# EAGLE design individual-board (EAGLE 9.6.2)
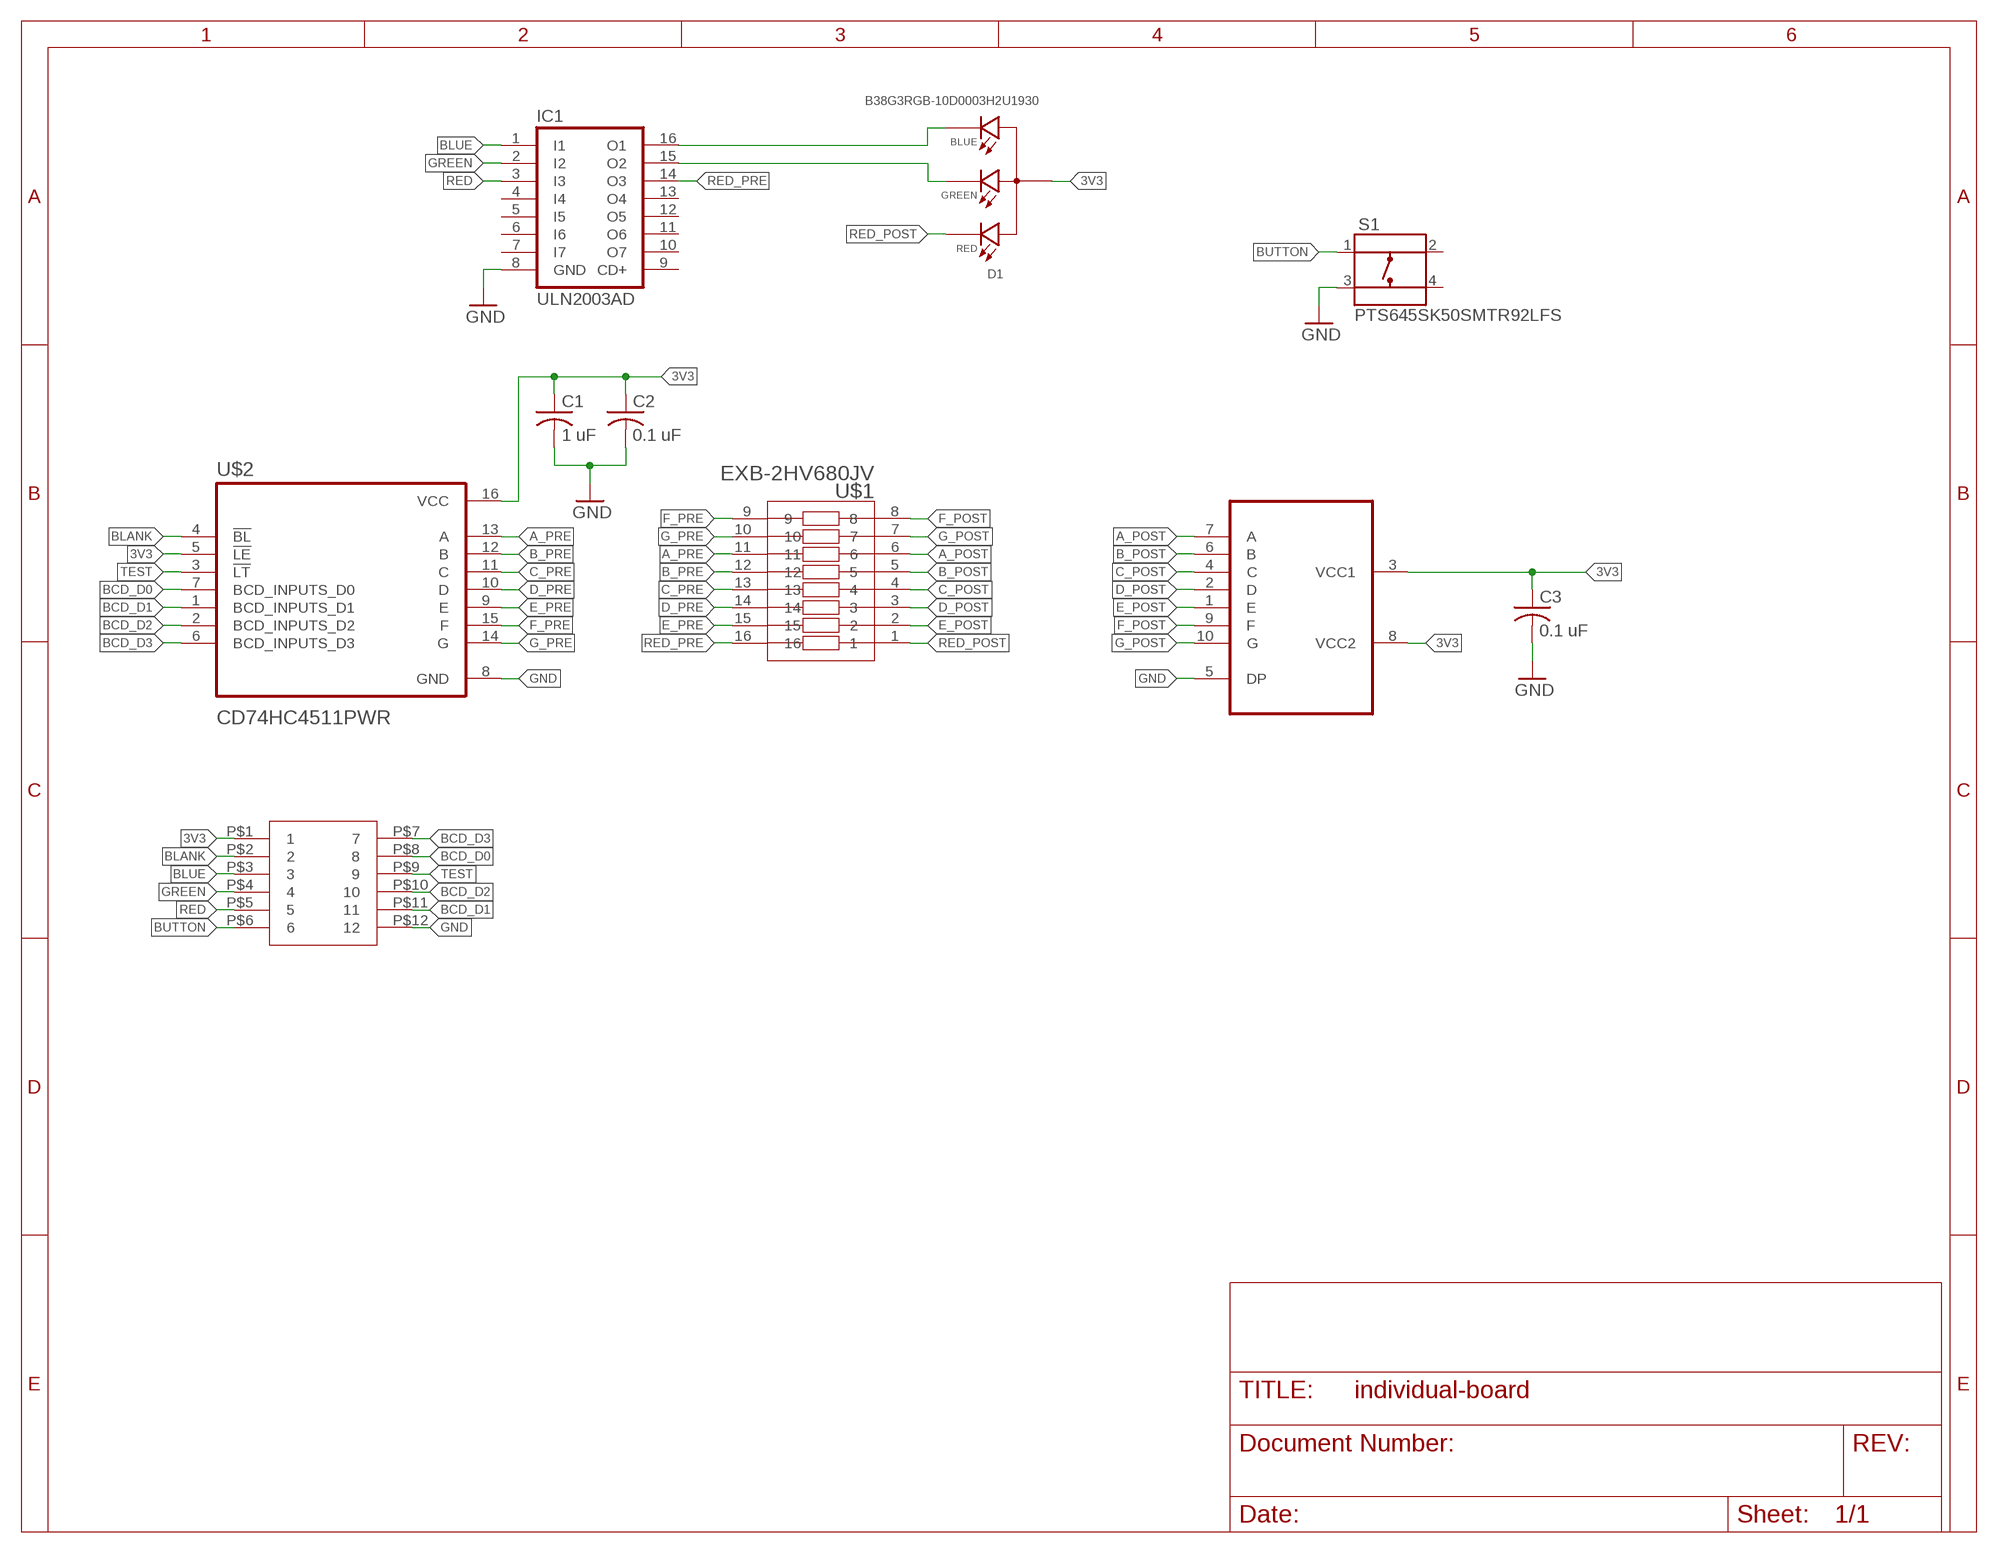
[diagram p0: schematic, sheet 1]

## Parts
C1  1 uF  C-USC0603  [C0603]
C2  0.1 uF  C-USC0603  [C0603]
C3  0.1 uF  C-USC0603  [C0603]
D1  B38G3RGB-10D0003H2U1930  [LED_B38G3RGB-10D0003H2U1930]
IC1  ULN2003AD  [SO16]
S1  PTS645SK50SMTR92LFS  [SW_PTS645SK50SMTR92LFS]
U$1  EXB-2HV680JV  EXB-2HV101JV  [2HV]
U$2  CD74HC4511PWR  [CD74HC4511PWR]
U$3  INND-SS30RAB  [INND-SS30RAB]
U$4  2X6-EDGE-CONNECTOR  [2X6-EDGE-CONNECTOR]

## Nets
3V3: C1.1 C2.1 C3.1 D1.3(A) U$2.5(!LE) U$2.16(VCC) U$3.3(VCC1) U$3.8(VCC2) U$4.P$1
A_POST: U$1.6 U$3.7(A)
A_PRE: U$1.11 U$2.13(A)
B_POST: U$1.5 U$3.6(B)
B_PRE: U$1.12 U$2.12(B)
BCD_D0: U$2.7(BCD_INPUTS_D0) U$4.P$8
BCD_D1: U$2.1(BCD_INPUTS_D1) U$4.P$11
BCD_D2: U$2.2(BCD_INPUTS_D2) U$4.P$10
BCD_D3: U$2.6(BCD_INPUTS_D3) U$4.P$7
BLANK: U$2.4(!BL) U$4.P$2
BLUE: IC1.1(I1) U$4.P$3
BUTTON: S1.1 U$4.P$6
C_POST: U$1.4 U$3.4(C)
C_PRE: U$1.13 U$2.11(C)
D_POST: U$1.3 U$3.2(D)
D_PRE: U$1.14 U$2.10(D)
E_POST: U$1.2 U$3.1(E)
E_PRE: U$1.15 U$2.9(E)
F_POST: U$1.8 U$3.9(F)
F_PRE: U$1.9 U$2.15(F)
G_POST: U$1.7 U$3.10(G)
G_PRE: U$1.10 U$2.14(G)
GND: C1.2 C2.2 C3.2 IC1.8(GND) S1.3 U$2.8(GND) U$3.5(DP) U$4.P$12
GREEN: IC1.2(I2) U$4.P$4
N$8: D1.2(B_C) IC1.16(O1)
N$17: D1.1(G_C) IC1.15(O2)
RED: IC1.3(I3) U$4.P$5
RED_POST: D1.4(R_C) U$1.1
RED_PRE: IC1.14(O3) U$1.16
TEST: U$2.3(!LT) U$4.P$9
Unconnected: IC1.4(I4) IC1.5(I5) IC1.6(I6) IC1.7(I7) IC1.9(CD+) IC1.10(O7) IC1.11(O6) IC1.12(O5) IC1.13(O4) S1.2 S1.4

## Library data of the parts
C1-C3 = rcl:C-US: CAPACITOR, American symbol; SPICEPREFIX: C
D1 = B38G3RGB-10D0003H2U1930:B38G3RGB-10D0003H2U1930; DESCRIPTION: Red, Green, Blue (RGB) - LED Indication - Discrete 2V Red, 3V Green, 3V Blue 0606 (1616 Metric); DIGI-KEY_PART_NUMBER: 3147-B38G3RGB-10D0003H2U1930TR-ND; MF: Harvatek Corporation; MP: B38G3RGB-10D0003H2U1930; PACKAGE: None; PURCHASE-URL: https://pricing.snapeda.com/search/part/B38G3RGB-10D0003H2U1930/?ref=eda
IC1 = uln-udn:ULN2003A: DRIVER ARRAY
S1 = PTS645SL70SMTR92LFS:PTS645SK50SMTR92LFS: Switch Tactile N.O. SPST Round Button Gull Wing 0.05A 12VDC 100000Cycles 2.55N SMD T/R; DESCRIPTION: Tactile Switch SPST-NO Top Actuated Surface Mount; DIGI-KEY_PART_NUMBER: CKN9087TR-ND; MF: C&K; MP: PTS645SK50SMTR92LFS; PACKAGE: None; PURCHASE-URL: https://pricing.snapeda.com/search/part/PTS645SK50SMTR92LFS/?ref=eda
U$1 = EXB-2HV101JV:EXB-2HV101JV; DESCRIPTION: 100 Ohm ±5% 62.5mW Power Per Element Isolated 8 Resistor Network/Array ±200ppm/°C 1506, Convex, Long Side Terminals; DIGI-KEY_PART_NUMBER: Y1101TR-ND; MF: Panasonic Electronic; MP: EXB-2HV101JV; PACKAGE: 1506 Panasonic; PURCHASE-URL: https://pricing.snapeda.com/search/part/EXB-2HV101JV/?ref=eda
U$2 = CD74HC4511PWR:CD74HC4511PWR
U$3 = INND-SS30RAB:INND-SS30RAB
U$4 = 2x6-edge-connector:2X6-EDGE-CONNECTOR

## Board
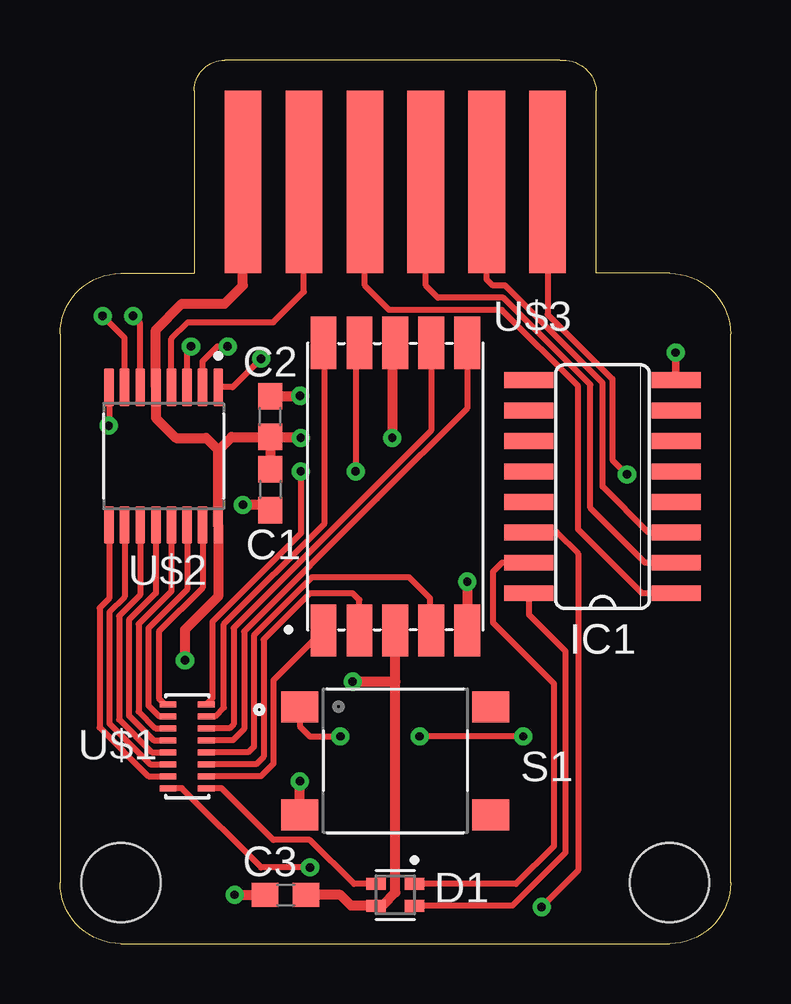
[diagram p1: board, top side]
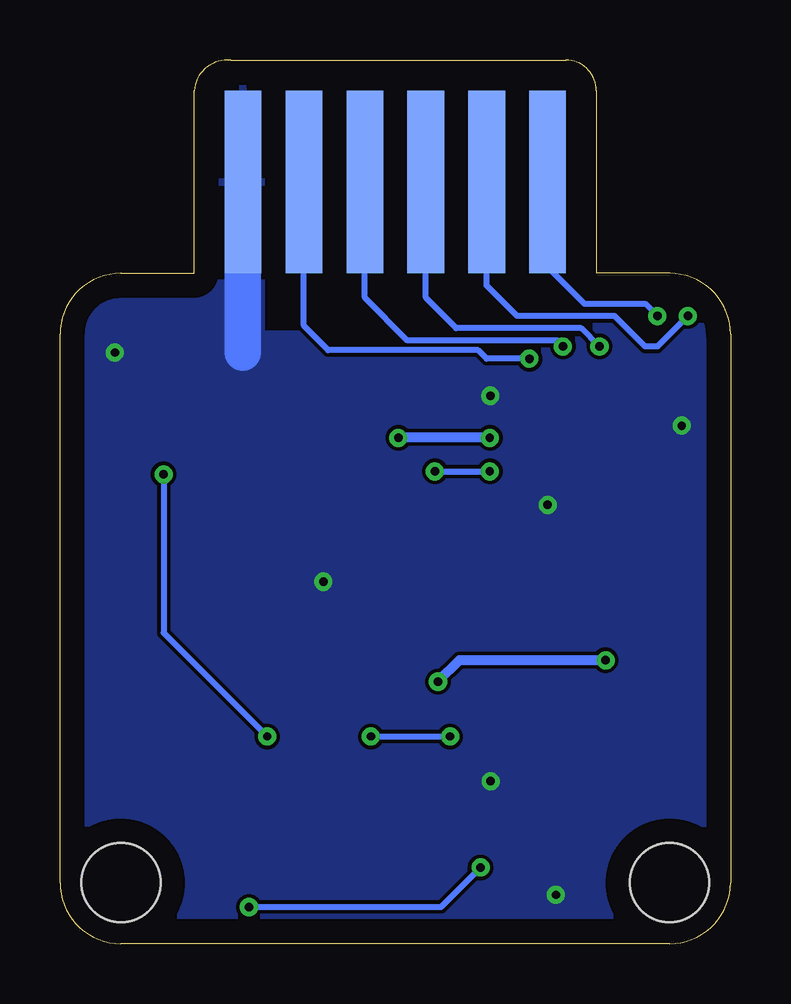
[diagram p2: board, bottom side, seen from below]

Size 27.94 x 36.84 mm. Coordinates in mm from the lower left corner, seen from the top.
Outline: 2.54,0 25.4,0 arc90 27.94,2.54 27.94,25.4 arc90 25.4,27.94 22.35,27.94 22.35,35.56 arc90 20.83,36.83 6.86,36.83 arc90 5.59,35.56 5.59,27.94 2.54,27.94 arc90 0,25.4 0,2.54 arc90 2.54,0
Copper layers (1*16): Top 0.035mm / dielectric 1.5mm / Bottom 0.035mm
Design rules "default": minimum track width 6mil, minimum drill 0.35mm, track to track 6mil, track to pad 6mil, pad to pad 6mil, via to via 6mil, smd to smd 6mil, copper to edge 40mil, drill to drill 6mil, minimum pad ring 10mil, minimum via ring 8mil, stop-mask expansion 4mil, vias tented up to drill 0mil, thermal gap 10mil
Holes 3.3 mm at 2.54,2.54 25.4,2.54

### Footprints (pad centres in the part's own frame; a part is rotated, then mirrored left to right if it is on the bottom)
C0603 = smd 1.1 x 1: 1 -0.85,0; 2 0.85,0
LED_B38G3RGB-10D0003H2U1930 = smd 0.5 x 0.8: 1 -0.45,0.8; 2 0.45,0.8; 3 0.45,-0.8; 4 -0.45,-0.8
SO16 = smd 0.66 x 2.032: 1 -4.445,-3.073; 2 -3.175,-3.073; 3 -1.905,-3.073; 4 -0.635,-3.073; 5 0.635,-3.073; 6 1.905,-3.073; 7 3.175,-3.073; 8 4.445,-3.073; 9 4.445,3.073; 10 3.175,3.073; 11 1.905,3.073; 12 0.635,3.073; 13 -0.635,3.073; 14 -1.905,3.073; 15 -3.175,3.073; 16 -4.445,3.073
SW_PTS645SK50SMTR92LFS = smd 1.55 x 1.3: 1 -3.975,2.25; 2 3.975,2.25; 3 -3.975,-2.25; 4 3.975,-2.25
2HV = smd 0.25 x 0.7: 1 0,0; 2 0.5,0; 3 1,0; 4 1.5,0; 5 2,0; 6 2.5,0; 7 3,0; 8 3.5,0; 9 3.5,1.6; 10 3,1.6; 11 2.5,1.6; 12 2,1.6; 13 1.5,1.6; 14 1,1.6; 15 0.5,1.6; 16 0,1.6
CD74HC4511PWR = smd 1.57 x 0.41: 1 -2.87,2.275; 2 -2.87,1.625; 3 -2.87,0.975; 4 -2.87,0.325; 5 -2.87,-0.325; 6 -2.87,-0.975; 7 -2.87,-1.625; 8 -2.87,-2.275; 9 2.87,-2.275; 10 2.87,-1.625; 11 2.87,-0.975; 12 2.87,-0.325; 13 2.87,0.325; 14 2.87,0.975; 15 2.87,1.625; 16 2.87,2.275
INND-SS30RAB = smd 1.067 x 2.184: 1 -2.997,-5.994; 2 -1.499,-5.994; 3 0,-5.994; 4 1.499,-5.994; 5 2.997,-5.994; 6 2.997,5.994; 7 1.499,5.994; 8 0,5.994; 9 -1.499,5.994; 10 -2.997,5.994
2X6-EDGE-CONNECTOR = smd 1.524 x 7.62: P$1 -6.35,3.81; P$2 -3.81,3.81; P$3 -1.27,3.81; P$4 1.27,3.81; P$5 3.81,3.81; P$6 6.35,3.81 | smd 1.524 x 7.62 bottom: P$7 -6.35,3.81; P$8 -3.81,3.81; P$9 -1.27,3.81; P$10 1.27,3.81; P$11 3.81,3.81; P$12 6.35,3.81

### Placement (x,y rotation side)
C1  8.76,18.92 270 top
C2  8.76,21.97 90 top
C3  9.4,2.03 180 top
D1  13.97,2.03 270 top
IC1  22.61,19.05 90 top
S1  13.97,7.62 0 top
U$1  6.1,6.48 90 top
U$2  4.32,20.32 270 top
U$3  13.97,19.05 0 top
U$4  13.97,27.94 0 top

### Tracks (layer width: path | path; a pad name or v marks a point on that pad's centre or on a via)
3V3  (via drill 0.35)
  Top 0.406: 13.97,10.92 13.97,2.13 13.42,1.58 D1.3 12.13,1.58 11.68,2.03 C3.1 | 13.97,10.92 U$3.3 | U$4.P$1 7.62,27.43 6.86,26.67 5.08,26.67 3.99,25.58 U$2.5 3.99,21.91 4.83,21.08 6.08,21.08 6.59,20.57 6.59,20.56 | U$2.16 6.59,19.32 | C2.1 C1.1 | U$2.16 6.59,20.56 | C2.1 7.15,21.12 6.59,20.56 | v5.21,11.81 5.21,13.08 6.59,14.47 U$2.16 | v12.19,10.92 13.97,10.92 | C2.1 9.99,21.12 v10.03,21.08 | U$3.8 13.84,24.92 v13.84,21.08
  Bottom 0.406: v5.21,11.81 11.3,11.81 v12.19,10.92 | v13.84,21.08 13.82,21.11 10.06,21.11 v10.03,21.08
A_POST
  Top 0.254: U$3.7 15.47,21.38 7.24,13.15 7.24,9.14 7.07,8.98 U$1.6
A_PRE
  Top 0.254: U$2.13 4.64,14.68 3.28,13.32 3.28,9.68 3.98,8.98 U$1.11
B_POST
  Top 0.254: U$1.5 7.21,8.48 7.67,8.94 7.67,13.01 13.21,18.55 16.97,22.31 U$3.6
B_PRE
  Top 0.254: U$2.12 3.99,14.61 2.87,13.48 2.87,9.51 3.9,8.48 U$1.12
BCD_D0  (via drill 0.35)
  Top 0.254: U$2.7 2.69,25.25 v1.78,26.16
  Bottom 0.254: v1.78,26.16 3.05,24.89 3.56,24.89 4.83,26.16 8.89,26.16 10.16,27.43 U$4.P$8
BCD_D1  (via drill 0.35)
  Top 0.254: v8.38,24.38 7.19,23.19 U$2.1
  Bottom 0.254: v8.38,24.38 10.16,24.38 10.52,24.74 16.76,24.74 17.78,25.76 U$4.P$11
BCD_D2  (via drill 0.35)
  Top 0.254: U$2.2 5.93,23.2 5.93,24.26 6.56,24.89 v6.99,24.89
  Bottom 0.254: v6.99,24.89 7.24,25.15 13.46,25.15 15.24,26.92 U$4.P$10
BCD_D3  (via drill 0.35)
  Top 0.254: U$2.6 3.34,25.87 v3.05,26.16
  Bottom 0.254: U$4.P$7 7.62,28.19 6.1,26.67 3.56,26.67 v3.05,26.16
BLANK
  Top 0.254: U$2.4 4.64,25.22 5.33,25.91 8.89,25.91 10.16,27.18 U$4.P$2
BLUE
  Top 0.254: IC1.1 24.26,14.61 21.59,17.27 21.59,23.23 18.41,26.42 13.72,26.42 12.7,27.43 U$4.P$3
BUTTON  (via drill 0.35)
  Top 0.254: S1.1 9.99,9.05 10.41,8.64 v11.68,8.64 | U$4.P$6 20.32,26.23 23.01,23.54 23.01,20.17 v23.62,19.56 | v19.3,8.64 v14.99,8.64
  Bottom 0.254: v23.62,19.56 23.62,12.95 v19.3,8.64 | v14.99,8.64 v11.68,8.64
C_POST
  Top 0.254: U$3.4 15.42,13.11 15.42,14.39 14.54,15.27 10.5,15.27 8.08,12.84 8.08,8.21 7.84,7.98 U$1.4
C_PRE
  Top 0.254: U$2.11 3.34,14.53 2.46,13.65 2.46,9.34 3.83,7.98 U$1.13
D_POST
  Top 0.254: U$3.2 12.47,14.33 12.19,14.61 10.41,14.61 8.48,12.68 8.48,7.79 8.17,7.48 U$1.3
D_PRE
  Top 0.254: U$2.10 2.69,14.46 2.06,13.82 2.06,9.17 3.75,7.48 U$1.14
E_POST
  Top 0.254: U$3.1 8.89,10.97 8.89,7.49 8.37,6.98 U$1.2
E_PRE
  Top 0.254: U$2.9 2.04,14.38 1.65,13.99 1.65,9 3.68,6.98 U$1.15
F_POST  (via drill 0.35)
  Top 0.254: U$3.9 12.32,24.89 v12.32,19.68 | v10.03,19.68 10.03,17.1 6.35,13.41 6.35,10.23 U$1.8
  Bottom 0.254: v12.32,19.68 v10.03,19.68
F_PRE
  Top 0.254: U$2.15 5.94,14.83 4.12,13.01 4.12,10.23 4.37,9.98 U$1.9
G_POST
  Top 0.254: U$1.7 6.47,9.48 6.83,9.84 6.83,13.32 11.03,17.52 11.03,24.99 U$3.10
G_PRE
  Top 0.254: U$2.14 5.29,14.76 3.68,13.15 3.68,9.92 4.13,9.48 U$1.10
GND  (via drill 0.35)
  Top 0.254: U$2.8 2.04,21.6 v2.03,21.59
  Top 0.305: IC1.8 25.65,23.5 v25.65,24.64
  Top 0.406: S1.3 v9.99,6.77 | v7.28,2.03 C3.2 | v16.97,15.09 U$3.5 | C2.2 9.99,22.82 v10.01,22.84 | C1.2 8.55,18.29 v7.62,18.29
  Bottom 1.524: U$4.P$12 20.32,24.64
  pour Bottom: 0,27.94 5.59,27.94 5.59,25.4 19.56,25.4 19.56,36.83 27.94,36.83 27.94,0 0,0
GREEN
  Top 0.254: IC1.2 24.38,15.88 22.1,18.16 22.1,23.3 18.48,26.92 15.75,26.92 15.24,27.43 U$4.P$4
N$8
  Top 0.254: IC1.16 19.53,13.72 21.06,12.19 21.06,3.79 18.85,1.58 D1.2
N$17
  Top 0.254: IC1.15 18.41,15.88 18.03,15.49 18.03,13.38 20.57,10.84 20.57,4.06 18.99,2.48 D1.1
RED
  Top 0.254: IC1.3 24.51,17.14 22.61,19.05 22.61,23.37 18.54,27.43 18.03,27.43 17.78,27.69 U$4.P$5
RED_POST
  Top 0.254: D1.4 12.25,2.48 10.41,4.32 8.89,4.32 6.73,6.48 U$1.1
RED_PRE  (via drill 0.35)
  Top 0.254: IC1.14 20.7,17.14 21.59,16.26 21.59,3.05 v20.07,1.52 | v10.41,3.17 8.38,3.17 5.08,6.48 U$1.16
  Bottom 0.254: v20.07,1.52 12.06,1.52 v10.41,3.17
TEST  (via drill 0.35)
  Top 0.254: U$2.3 5.29,24.72 v5.46,24.89
  Bottom 0.254: v5.46,24.89 6.22,25.65 11.43,25.65 12.7,26.92 U$4.P$9